# Altium schematic sheet 1_ATmega SoC.schdoc.schdoc
size 309 x 223 mm; Symbol: Sheet-Symbol_A4; Device: Sheet-Symbol_A4; Company: EasyEDA.com; Drawed: EasyEDA Pro; Reviewed: EasyEDA Pro; Version: V0.1; Page Size: A4; @Project Name: AutoPilot; @Page Count: 3; @Update Date: 2024-01-26; @Create Date: 2023-12-14; @Schematic Name: Schematic1; Part Number: JLCPCB-002; @Page No: 3; @Page Name: ATmega SoC
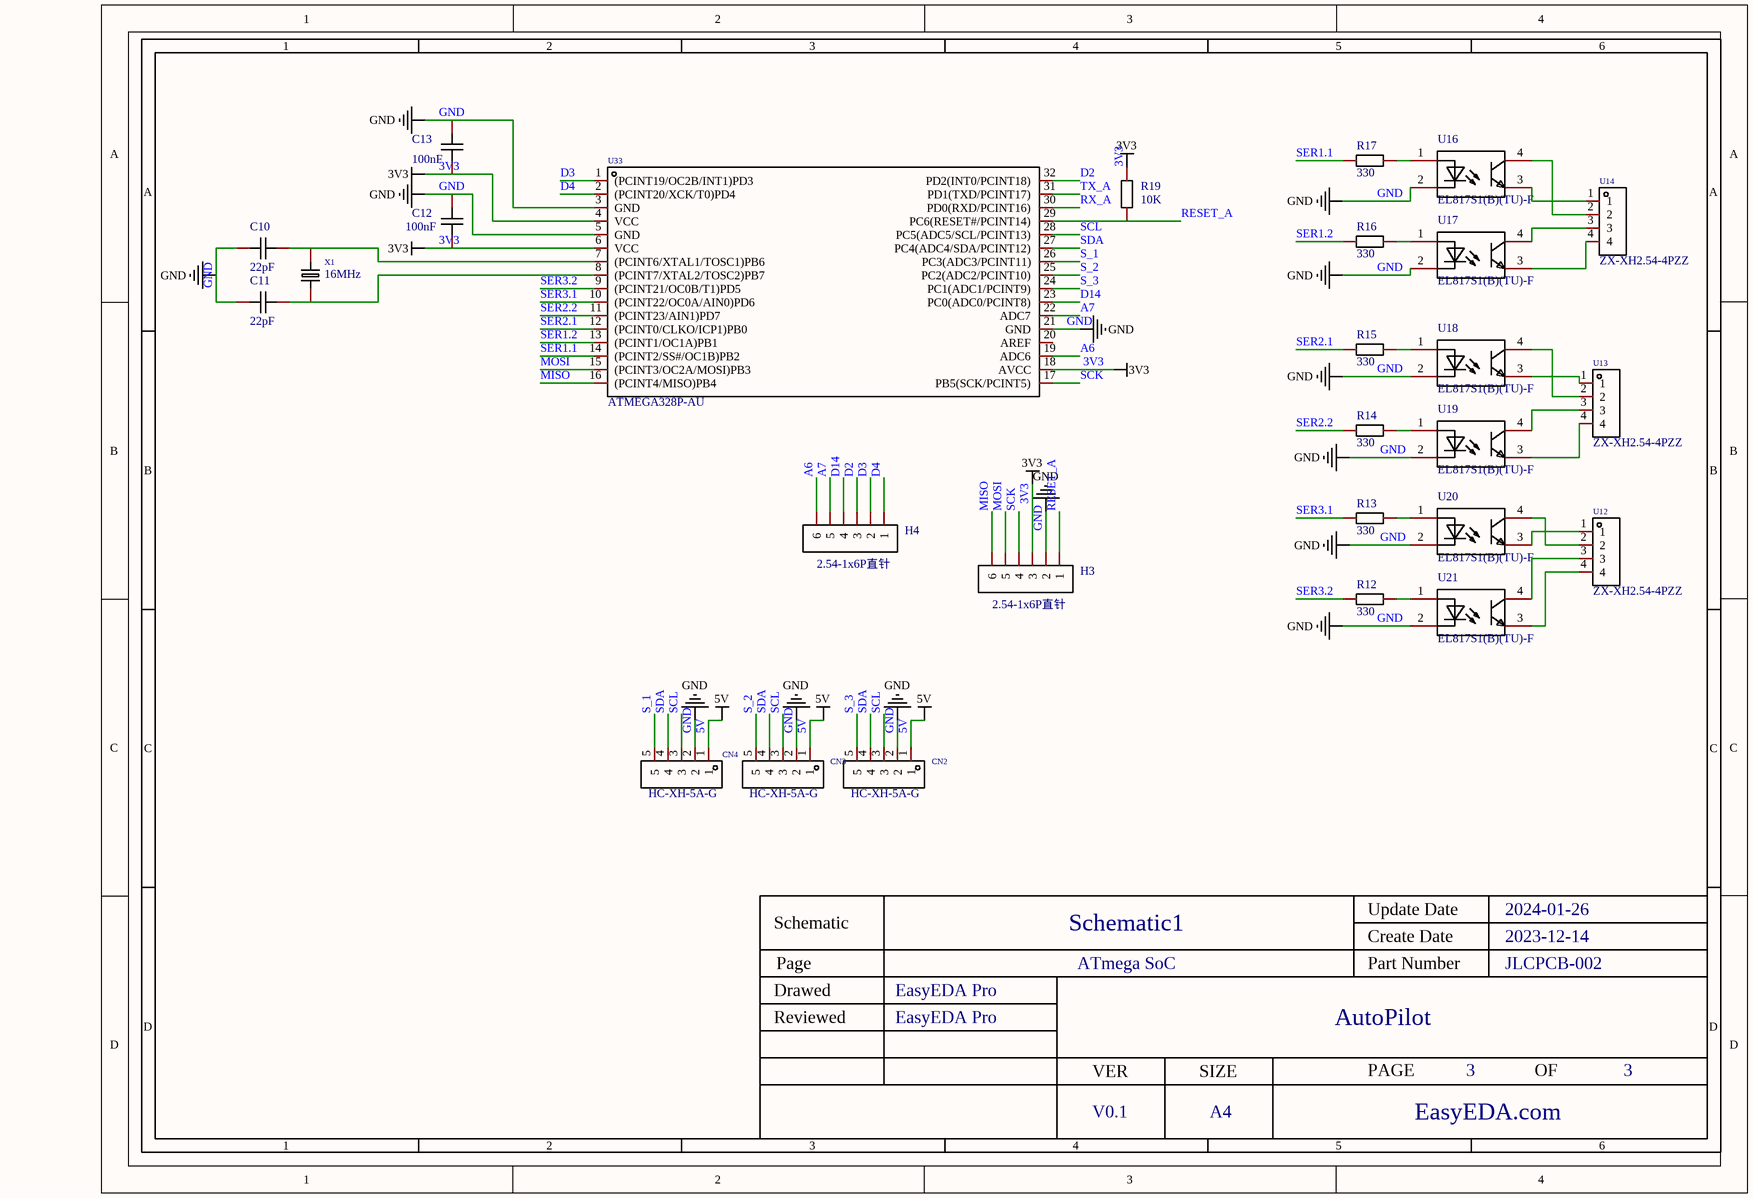
[diagram p0: 1_ATmega SoC.schdoc.schdoc]

## Parts
C10  22pF  [C0603]
C11  22pF  [C0603]
C12  100nF  [C0402]
C13  100nF  [C0402]
CN2  HC-XH-5A-G  [CONN-TH_5P-P2.50_HC-XH-5A-G]
CN3  HC-XH-5A-G  [CONN-TH_5P-P2.50_HC-XH-5A-G]
CN4  HC-XH-5A-G  [CONN-TH_5P-P2.50_HC-XH-5A-G]
H3  2.54-1x6P直针  [HDR-TH_6P-P2.54-V-M-1]
H4  2.54-1x6P直针  [HDR-TH_6P-P2.54-V-M-1]
R12  330  [R0603]
R13  330  [R0603]
R14  330  [R0603]
R15  330  [R0603]
R16  330  [R0603]
R17  330  [R0603]
R19  10K  [R0402]
U12  ZX-XH2.54-4PZZ  [CONN-TH_4P-P2.50_4PIN]
U13  ZX-XH2.54-4PZZ  [CONN-TH_4P-P2.50_4PIN]
U14  ZX-XH2.54-4PZZ  [CONN-TH_4P-P2.50_4PIN]
U16  EL817S1(B)(TU)-F  [SOP-4_L6.5-W4.6-P2.54-LS10.2-TL]
U17  EL817S1(B)(TU)-F  [SOP-4_L6.5-W4.6-P2.54-LS10.2-TL]
U18  EL817S1(B)(TU)-F  [SOP-4_L6.5-W4.6-P2.54-LS10.2-TL]
U19  EL817S1(B)(TU)-F  [SOP-4_L6.5-W4.6-P2.54-LS10.2-TL]
U20  EL817S1(B)(TU)-F  [SOP-4_L6.5-W4.6-P2.54-LS10.2-TL]
U21  EL817S1(B)(TU)-F  [SOP-4_L6.5-W4.6-P2.54-LS10.2-TL]
U33  ATMEGA328P-AU  [TQFP-32_L7.0-W7.0-P0.80-LS9.0-BL]
X1  16MHz  [HC-49S_L11.4-W4.8]

## Nets
3V3: C12.2 C13.2 H3.3 R19.2 U33.4(VCC) U33.6(VCC) U33.18(AVCC)
5V: CN2.1 CN3.1 CN4.1
GND: C10.2 C11.2 C12.1 C13.1 CN2.2 CN3.2 CN4.2 H3.2 U16.2(CAT) U17.2(CAT) U18.2(CAT) U19.2(CAT) U20.2(CAT) U21.2(CAT) U33.3(GND) U33.5(GND) U33.21(GND)
A6: H4.6 U33.19(ADC6)
A7: H4.5 U33.22(ADC7)
D2: H4.3 U33.32(PD2(INT0/PCINT18))
D3: H4.2 U33.1((PCINT19/OC2B/INT1)PD3)
D4: H4.1 U33.2((PCINT20/XCK/T0)PD4)
D14: H4.4 U33.23(PC0(ADC0/PCINT8))
MISO: H3.6 U33.16((PCINT4/MISO)PB4)
MOSI: H3.5 U33.15((PCINT3/OC2A/MOSI)PB3)
RESET_A: H3.1 R19.1 U33.29(PC6(RESET#/PCINT14))
RX_A: U33.30(PD0(RXD/PCINT16))
S_1: CN4.5 U33.26(PC3(ADC3/PCINT11))
S_2: CN3.5 U33.25(PC2(ADC2/PCINT10))
S_3: CN2.5 U33.24(PC1(ADC1/PCINT9))
SCK: H3.4 U33.17(PB5(SCK/PCINT5))
SCL: CN2.3 CN3.3 CN4.3 U33.28(PC5(ADC5/SCL/PCINT13))
SDA: CN2.4 CN3.4 CN4.4 U33.27(PC4(ADC4/SDA/PCINT12))
SER1.1: R17.1 U33.14((PCINT2/SS#/OC1B)PB2)
SER1.2: R16.1 U33.13((PCINT1/OC1A)PB1)
SER2.1: R15.1 U33.12((PCINT0/CLKO/ICP1)PB0)
SER2.2: R14.1 U33.11((PCINT23/AIN1)PD7)
SER3.1: R13.1 U33.10((PCINT22/OC0A/AIN0)PD6)
SER3.2: R12.1 U33.9((PCINT21/OC0B/T1)PD5)
TX_A: U33.31(PD1(TXD/PCINT17))
NetC10_1: C10.1 U33.7((PCINT6/XTAL1/TOSC1)PB6) X1.2
NetC11_1: C11.1 U33.8((PCINT7/XTAL2/TOSC2)PB7) X1.1
NetR12_2: R12.2 U21.1(AN)
NetR13_2: R13.2 U20.1(AN)
NetR14_2: R14.2 U19.1(AN)
NetR15_2: R15.2 U18.1(AN)
NetR16_2: R16.2 U17.1(AN)
NetR17_2: R17.2 U16.1(AN)
NetU12_1: U12.1 U20.3(EM)
NetU12_2: U12.2 U20.4(COL)
NetU12_3: U12.3 U21.4(COL)
NetU12_4: U12.4 U21.3(EM)
NetU13_1: U13.1 U18.3(EM)
NetU13_2: U13.2 U18.4(COL)
NetU13_3: U13.3 U19.4(COL)
NetU13_4: U13.4 U19.3(EM)
NetU14_1: U14.1 U16.3(EM)
NetU14_2: U14.2 U16.4(COL)
NetU14_3: U14.3 U17.4(COL)
NetU14_4: U14.4 U17.3(EM)

Not connected (* = marked no-connect by the designer): U33 20(AREF)

## Notes on the sheet
- 1
- 2
- 3
- 4
- 5
- 6
- A
- B
- C
- Schematic
- Schematic1
- Create Date
- Update Date
- 2024-01-26
- 2023-12-14
- Reviewed
- Drawed
- Page
- EasyEDA Pro
- ATmega SoC
- Part Number
- AutoPilot
- JLCPCB-002
- D
- VER
- SIZE
- PAGE
- OF
- V0.1
- A4
- EasyEDA.com

## Library data of the parts
C10-C13 = CAP_0603: Symbol: CAP; Convert to PCB: yes; Device: CAP_0603; Add into BOM: yes; Supplier Footprint: 0603
  C10 C11: Name: 22pF; Value: 22pF
  C12 C13: Name: 100nF; Value: 100nF
CN2-CN4 = HC-XH-5A-G: Pins Structure:1x5P Pitch:2.54mm Gender:公 Mounting Style:Straight Row Spacing:2.54mm Number of Rows:1 Number of PINs Per Row:5 Reference Series:XH Current Rating (Max):3A Operating Temperature Range:-25℃~+85℃ Operating Temperature Range:-25℃~+85℃; Manufacturer: HCTL(华灿天禄); Add into BOM: yes; Pins Structure: 1x5P; Pitch: 2.54mm; Gender: 公; Number of PINs Per Row: 5; Reference Series: XH; Current Rating (Max): 3A; Name: HC-XH-5A-G; Symbol: HC-XH-5A-G; Device: HC-XH-5A-G; LCSC Part Name: 1x5P 间距:2.54mm 直插 系列:XH; Supplier Part: C5341204; Manufacturer Part: HC-XH-5A-G; Supplier Footprint: 插件,P=2.5mm; JLCPCB Part Class: Extended Part; Datasheet: https://atta.szlcsc.com/upload/public/pdf/source/20230711/68D365716984B4AFE576D1D73D61B465.pdf; Supplier: LCSC; Convert to PCB: yes; Mounting Style: Straight; Row Spacing: 2.54mm; Number of Rows: 1; Operating Temperature Range: -25℃~+85℃
H3 H4 = 2.54-1x6P直针: Number of Rows:单排 Number of Pins:6 Pitch:2.54mm Pin Structure:1x6P Row Spacing:- Mounting Type:Straight Circluar Pins/Square Pins:Square Pins Current Rating (Max):3A Voltage Rating (Max):- Length of Mating Pin:- Insulation Height:- Contact Material: Conta; Manufacturer: BOOMELE(博穆精密); Symbol: Header-Male-2.54_1x6; Add into BOM: yes; Pitch: 2.54mm; Pin Structure: 1x6P; Current Rating (Max): 3A; Name: 2.54-1x6P直针; Device: 2.54-1x6P直针; LCSC Part Name: 2.54mm 1x6P 直插 方针; Supplier Part: C37208; Manufacturer Part: 2.54-1x6P直针; Supplier Footprint: 直插,P=2.54mm; JLCPCB Part Class: Extended Part; Supplier: LCSC; Convert to PCB: yes; Number of Rows: 单排; Number of Pins: 6; Row Spacing: -; Mounting Type: Straight; Circluar Pins/Square Pins: Square Pins; Voltage Rating (Max): -; Length of Mating Pin: -; Insulation Height: -; Contact Plating: -; Operating Temperature Range: -40℃~+105℃; Color: Black
R12-R17 R19 = Res_0603: Symbol: Res; Convert to PCB: yes; Device: Res_0603; Add into BOM: yes; Supplier Footprint: 0603
  R12-R17: Name: 330; Value: 330
  R19: Name: 10K; Value: 10K
U12-U14 = ZX-XH2.54-4PZZ: Reference Series:XH Pitch:2.54mm Pins Structure:1x4P Number of Rows:1 Number of PINs Per Row:4 Row Spacing:- Gender:公型插针 Mounting Style:Straight Current Rating (Max):3A Contact Material:Brass Contact Plating:Tin Operating Temperature Range:-25℃~+85℃ Opera; Manufacturer: Megastar(兆星); Add into BOM: yes; Reference Series: XH; Pitch: 2.54mm; Pins Structure: 1x4P; Number of PINs Per Row: 4; Gender: 公型插针; Current Rating (Max): 3A; Welding Temperature (Max): 260℃; Name: ZX-XH2.54-4PZZ; Symbol: ZX-XH2.54-4PZZ; Device: ZX-XH2.54-4PZZ; LCSC Part Name: 系列:XH 间距:2.54mm 1x4P 直插; Supplier Part: C7429634; Manufacturer Part: ZX-XH2.54-4PZZ; Supplier Footprint: 插件,P=2.54mm; JLCPCB Part Class: Extended Part; Datasheet: https://atta.szlcsc.com/upload/public/pdf/source/20230619/B529A2163E0159A644AB3383D208FB03.pdf; Supplier: LCSC; Convert to PCB: yes; Number of Rows: 1; Row Spacing: -; Mounting Style: Straight; Contact Material: Brass; Contact Plating: Tin; Operating Temperature Range: -25℃~+85℃
U16-U21 = EL817S1(B)(TU)-F: Input voltage type:DC Output Type:光电三极管 Number of Outputs:1 Forward Voltage:1.2V Reverse Voltage:6V Output Current:50mA Receiving End Voltage:35V Collector-Emitter Saturation Voltage (Vce(sat)@Ic,IF):0.1V@1mA,20mA Rise time:4us@2mA,100Ω Fall time:3us@2mA,; Manufacturer: EVERLIGHT(亿光); Add into BOM: yes; Input voltage type: DC; Output Type: 光电三极管; Number of Outputs: 1; Forward Voltage: 1.2V; Reverse Voltage: 6V; Output Current: 50mA; Receiving End Voltage: 35V; Fall time: 3us@2mA,100Ω; Isolation Voltage(rms): 5000V; Name: EL817S1(B)(TU)-F; Symbol: EL817S1(B)(TU)-F; Device: EL817S1(B)(TU)-F; LCSC Part Name: DC输入 隔离电压(rms):5000V; Supplier Part: C63268; Manufacturer Part: EL817S1(B)(TU)-F; Supplier Footprint: SOP-4-2.54mm; JLCPCB Part Class: Extended Part; Datasheet: https://atta.szlcsc.com/upload/public/pdf/source/20160318/1458266987275.pdf; Supplier: LCSC; Convert to PCB: yes; Collector-Emitter Saturation Voltage (Vce(sat)@Ic,IF): 0.1V@1mA,20mA; Rise time: 4us@2mA,100Ω; Operating Temperature: -55℃~+110℃
U33 = ATMEGA328P-AU_C14877: Application Area:- CPU Core:AVR CPU Maximum Speed:20MHz Operating Voltage Range:1.8V~5.5V Operating Voltage Range:1.8V~5.5V Program Storage Size:32KB Program Memory Type:FLASH RAM Size:2KB EEPROM:1KB GPIO Ports Number:23 ADC (Bit):10bit DAC (Bit):- PWM (B; Manufacturer: MICROCHIP(美国微芯); Add into BOM: yes; CPU Core: AVR; CPU Maximum Speed: 20MHz; Program Storage Size: 32KB; Program Memory Type: FLASH; RAM Size: 2KB; EEPROM: 1KB; GPIO Ports Number: 23; ADC (Bit): 10bit; Peripheral/Function: WDT；PWM；WDT；PWM; Watchdog: 有; Name: ATMEGA328P-AU; Symbol: ATMEGA328P-AU; Device: ATMEGA328P-AU_C14877; LCSC Part Name: ATMEGA328P-AU; Supplier Part: C14877; Manufacturer Part: ATMEGA328P-AU; Supplier Footprint: TQFP-32(7x7); JLCPCB Part Class: Extended Part; Datasheet: https://atta.szlcsc.com/upload/public/pdf/source/20140621/1457707095197.pdf; Supplier: LCSC; Convert to PCB: yes; Application Area: -; Operating Voltage Range: 1.8V~5.5V; DAC (Bit): -; PWM (Bit): -; 8Bit Timer: -; 16Bit Timer: -; 32Bit Timer: -; CAN: -; UART/USART: -; I2C: -; I2S: -; SPI: -; Universal Serial Bus: -; Internal Comparator: -; communication protocol: -; Real-Time Clock: -; Infrared Data Association: -; Low-Voltage Detect: 有; CCP Capture/Compare: -; LCD Module: -; LED Module: -; Secure Digital Input and Output: -; Direct Memory Access: -; Internal Oscillator: 有; Operating Temperature Range: -40℃~+85℃
X1 = TAXM16M2GLFBET2T: Crystal Type: Frequency: Load Capacitance: Equivalent Series Resistance (ESR):50Ω Frequency Tolerance:±30ppm Frequency Tolerance:±30ppm Frequency Stability:±30ppm Frequency Stability:±30ppm Operating Temperature: Operating Temperature:; Manufacturer: YJX(雅晶鑫); Symbol: HC-49SM16MHz20pF30ppm; Add into BOM: yes; Equivalent Series Resistance (ESR): 50Ω; Frequency Tolerance: ±30ppm; Name: 16MHz; Device: TAXM16M2GLFBET2T; LCSC Part Name: 16MHz ±30ppm 20pF; Supplier Part: C111377; Manufacturer Part: TAXM16M2GLFBET2T; Supplier Footprint: HC-49S-SMD; JLCPCB Part Class: Extended Part; Datasheet: https://atta.szlcsc.com/upload/public/pdf/source/20190305/C362352_AFD953984E9CF948957766F91AB56AA4.pdf; Supplier: LCSC; Convert to PCB: yes; Value: 16MHz; Frequency Stability: ±30ppm